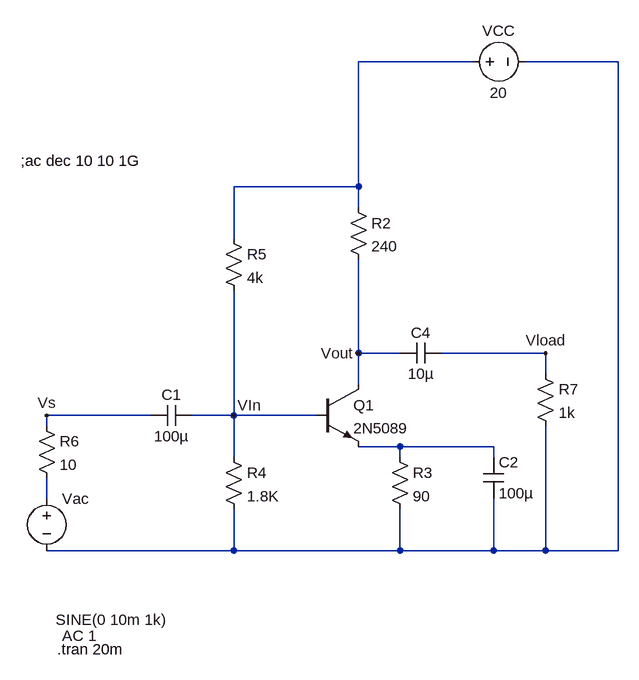
[diagram p0: schematic Common Collecter Amplifier.asc]
Common Collecter Amplifier.asc, the LTspice schematic file:
Version 4
SHEET 1 880 680
WIRE -1600 -2208 -1776 -2208
WIRE -1376 -2208 -1520 -2208
WIRE -1776 -2016 -1776 -2208
WIRE -1776 -2016 -1968 -2016
WIRE -1776 -1984 -1776 -2016
WIRE -1968 -1936 -1968 -2016
WIRE -1776 -1760 -1776 -1904
WIRE -1712 -1760 -1776 -1760
WIRE -1488 -1760 -1648 -1760
WIRE -1488 -1728 -1488 -1760
WIRE -1776 -1712 -1776 -1760
WIRE -2096 -1664 -2256 -1664
WIRE -1968 -1664 -1968 -1856
WIRE -1968 -1664 -2032 -1664
WIRE -1840 -1664 -1968 -1664
WIRE -2256 -1648 -2256 -1664
WIRE -1712 -1616 -1776 -1616
WIRE -1568 -1616 -1712 -1616
WIRE -1968 -1600 -1968 -1664
WIRE -1712 -1600 -1712 -1616
WIRE -1568 -1600 -1568 -1616
WIRE -2256 -1536 -2256 -1568
WIRE -1968 -1456 -1968 -1520
WIRE -1968 -1456 -2256 -1456
WIRE -1712 -1456 -1712 -1520
WIRE -1712 -1456 -1968 -1456
WIRE -1568 -1456 -1568 -1536
WIRE -1568 -1456 -1712 -1456
WIRE -1488 -1456 -1488 -1648
WIRE -1488 -1456 -1568 -1456
WIRE -1376 -1456 -1376 -2208
WIRE -1376 -1456 -1488 -1456
FLAG -1968 -1664 VIn
FLAG -1776 -1760 Vout
FLAG -1488 -1760 Vload
FLAG -2256 -1664 Vs
SYMBOL npn -1840 -1712 R0
SYMATTR InstName Q1
SYMATTR Value 2N5089
SYMBOL res -1728 -1616 R0
SYMATTR InstName R3
SYMATTR Value 90
SYMBOL res -1984 -1616 R0
SYMATTR InstName R4
SYMATTR Value 1.8K
SYMBOL cap -2032 -1680 R90
WINDOW 0 0 32 VBottom 2
WINDOW 3 32 32 VTop 2
SYMATTR InstName C1
SYMATTR Value 100µ
SYMBOL voltage -2256 -1552 R0
WINDOW 123 24 227 Left 2
WINDOW 39 0 0 Left 0
WINDOW 3 14 202 Left 2
SYMATTR Value2 AC 1
SYMATTR InstName Vac
SYMATTR Value SINE(0 10m 1k)
SYMBOL voltage -1616 -2208 R270
WINDOW 0 32 56 VTop 2
WINDOW 3 -32 56 VBottom 2
SYMATTR InstName VCC
SYMATTR Value 20
SYMBOL res -1792 -2000 R0
SYMATTR InstName R2
SYMATTR Value 240
SYMBOL cap -1648 -1776 R90
WINDOW 0 0 32 VBottom 2
WINDOW 3 32 32 VTop 2
SYMATTR InstName C4
SYMATTR Value 10µ
SYMBOL res -1984 -1952 R0
SYMATTR InstName R5
SYMATTR Value 4k
SYMBOL res -2272 -1664 R0
SYMATTR InstName R6
SYMATTR Value 10
SYMBOL res -1504 -1744 R0
SYMATTR InstName R7
SYMATTR Value 1k
SYMBOL cap -1584 -1600 R0
SYMATTR InstName C2
SYMATTR Value 100µ
TEXT -2240 -1304 Left 2 !.tran 20m
TEXT -2296 -2056 Left 2 !;ac dec 10 10 1G

The netlist it stands for:
* Common Collecter Amplifier.asc
Q1 Vout VIn N003 0 2N5089
R3 N003 N002 90
R4 VIn N002 1.8K
C1 VIn Vs 100µ
Vac N004 N002 SINE(0 10m 1k) AC 1
VCC N001 N002 20
R2 N001 Vout 240
C4 Vload Vout 10µ
R5 N001 VIn 4k
R6 Vs N004 10
R7 Vload N002 1k
C2 N003 N002 100µ
.model NPN NPN
.model PNP PNP
.lib standard.bjt
.tran 20m
;ac dec 10 10 1G
.backanno
.end